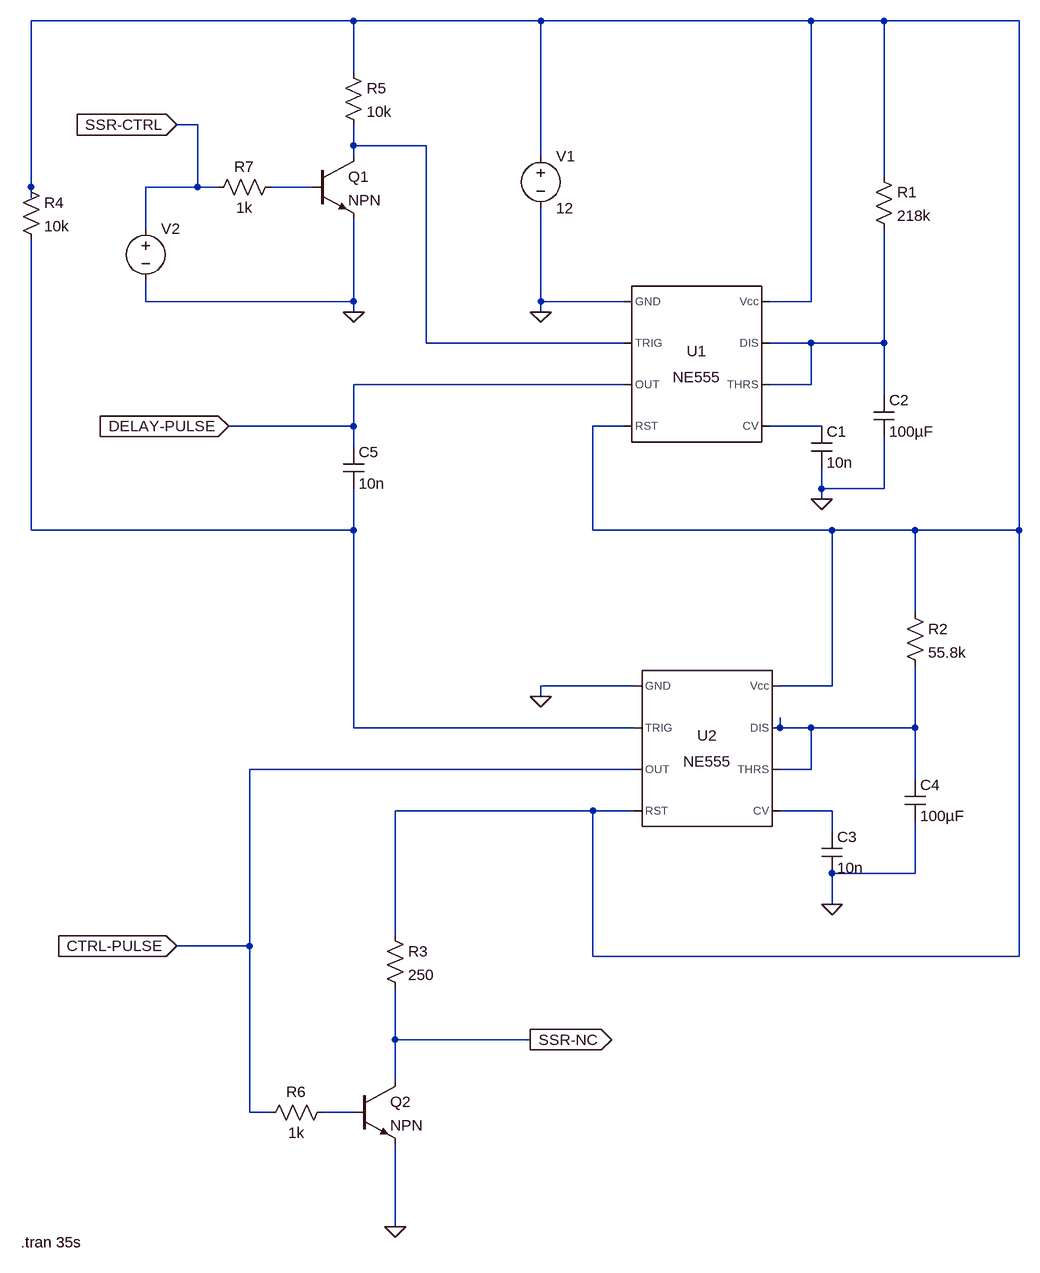
[diagram p0: schematic ssr_5v_pwr_ctrl.asc]
ssr_5v_pwr_ctrl.asc, the LTspice schematic file:
Version 4
SHEET 1 980 1544
WIRE -352 -352 -848 -352
WIRE -64 -352 -352 -352
WIRE 352 -352 -64 -352
WIRE 464 -352 352 -352
WIRE 672 -352 464 -352
WIRE -352 -272 -352 -352
WIRE -592 -192 -624 -192
WIRE -352 -160 -352 -192
WIRE -240 -160 -352 -160
WIRE -352 -144 -352 -160
WIRE -64 -144 -64 -352
WIRE 464 -112 464 -352
WIRE -848 -96 -848 -352
WIRE -592 -96 -592 -192
WIRE -592 -96 -672 -96
WIRE -560 -96 -592 -96
WIRE -416 -96 -480 -96
WIRE -848 -80 -848 -96
WIRE -672 -32 -672 -96
WIRE -672 80 -672 48
WIRE -352 80 -352 -48
WIRE -352 80 -672 80
WIRE -64 80 -64 -64
WIRE 64 80 -64 80
WIRE 352 80 352 -352
WIRE 352 80 288 80
WIRE -352 96 -352 80
WIRE -64 96 -64 80
WIRE -240 144 -240 -160
WIRE 64 144 -240 144
WIRE 352 144 288 144
WIRE 464 144 464 -32
WIRE 464 144 352 144
WIRE 64 208 -352 208
WIRE 352 208 352 144
WIRE 352 208 288 208
WIRE 464 224 464 144
WIRE -352 272 -352 208
WIRE -352 272 -544 272
WIRE 64 272 16 272
WIRE 368 272 288 272
WIRE -352 304 -352 272
WIRE 368 368 368 336
WIRE 464 368 464 288
WIRE 464 368 368 368
WIRE 368 384 368 368
WIRE -848 432 -848 -16
WIRE -352 432 -352 368
WIRE -352 432 -848 432
WIRE 16 432 16 272
WIRE 384 432 16 432
WIRE 512 432 384 432
WIRE 672 432 672 -352
WIRE 672 432 512 432
WIRE 512 560 512 432
WIRE 80 672 -64 672
WIRE 384 672 384 432
WIRE 384 672 304 672
WIRE -64 688 -64 672
WIRE -352 736 -352 432
WIRE 80 736 -352 736
WIRE 304 736 304 720
WIRE 352 736 304 736
WIRE 512 736 512 640
WIRE 512 736 352 736
WIRE 80 800 -512 800
WIRE 352 800 352 736
WIRE 352 800 304 800
WIRE 512 816 512 736
WIRE 16 864 -288 864
WIRE 80 864 16 864
WIRE 384 864 304 864
WIRE 384 896 384 864
WIRE 512 960 512 880
WIRE 512 960 384 960
WIRE 384 1008 384 960
WIRE -288 1056 -288 864
WIRE -512 1072 -512 800
WIRE -512 1072 -624 1072
WIRE 16 1088 16 864
WIRE 672 1088 672 432
WIRE 672 1088 16 1088
WIRE -288 1216 -288 1136
WIRE -80 1216 -288 1216
WIRE -288 1280 -288 1216
WIRE -512 1328 -512 1072
WIRE -480 1328 -512 1328
WIRE -352 1328 -400 1328
WIRE -288 1504 -288 1376
FLAG 368 384 0
FLAG -64 96 0
FLAG 384 1008 0
FLAG -64 688 0
FLAG -352 96 0
FLAG -288 1504 0
FLAG -80 1216 SSR-NC
IOPIN -80 1216 Out
FLAG -624 -192 SSR-CTRL
IOPIN -624 -192 In
FLAG -544 272 DELAY-PULSE
IOPIN -544 272 In
FLAG -624 1072 CTRL-PULSE
IOPIN -624 1072 In
SYMBOL Misc\\NE555 176 176 R0
SYMATTR InstName U1
SYMBOL cap 352 272 R0
SYMATTR InstName C1
SYMATTR Value 10n
SYMBOL res 448 -128 R0
SYMATTR InstName R1
SYMATTR Value 218k
SYMBOL cap 448 224 R0
SYMATTR InstName C2
SYMATTR Value 100µF
SYMBOL voltage -64 -160 R0
WINDOW 123 0 0 Left 2
WINDOW 39 0 0 Left 2
SYMATTR InstName V1
SYMATTR Value 12
SYMBOL voltage -672 -48 R0
WINDOW 3 24 96 Invisible 2
WINDOW 123 0 0 Left 2
WINDOW 39 0 0 Left 2
SYMATTR Value PULSE(0 3.3 1 0 0 0.1 1 1)
SYMATTR InstName V2
SYMBOL Misc\\NE555 192 768 R0
SYMATTR InstName U2
SYMBOL cap 368 896 R0
SYMATTR InstName C3
SYMATTR Value 10n
SYMBOL res 496 544 R0
SYMATTR InstName R2
SYMATTR Value 55.8k
SYMBOL cap 496 816 R0
SYMATTR InstName C4
SYMATTR Value 100µF
SYMBOL res -864 -112 R0
SYMATTR InstName R4
SYMATTR Value 10k
SYMBOL cap -368 304 R0
SYMATTR InstName C5
SYMATTR Value 10n
SYMBOL npn -416 -144 R0
SYMATTR InstName Q1
SYMBOL res -368 -288 R0
SYMATTR InstName R5
SYMATTR Value 10k
SYMBOL npn -352 1280 R0
SYMATTR InstName Q2
SYMBOL res -304 1040 R0
SYMATTR InstName R3
SYMATTR Value 250
SYMBOL res -384 1312 R90
WINDOW 0 0 56 VBottom 2
WINDOW 3 32 56 VTop 2
SYMATTR InstName R6
SYMATTR Value 1k
SYMBOL res -464 -112 R90
WINDOW 0 0 56 VBottom 2
WINDOW 3 32 56 VTop 2
SYMATTR InstName R7
SYMATTR Value 1k
TEXT -864 1528 Left 2 !.tran 35s

The netlist it stands for:
* ssr_5v_pwr_ctrl.asc
XU1 0 N002 DELAY-PULSE N001 N005 N004 N004 N001 NE555  ; pins GND TRIG OUT RST CV THRS DIS Vcc
C1 N005 0 10n
R1 N001 N004 218k
C2 N004 0 100µF
V1 N001 0 12
V2 SSR-CTRL 0 PULSE(0 3.3 1 0 0 0.1 1 1)
XU2 0 N006 CTRL-PULSE N001 N008 N007 N007 N001 NE555  ; pins GND TRIG OUT RST CV THRS DIS Vcc
C3 N008 0 10n
R2 N001 N007 55.8k
C4 N007 0 100µF
R4 N001 N006 10k
C5 DELAY-PULSE N006 10n
Q1 N002 N003 0 0 NPN
R5 N001 N002 10k
Q2 SSR-NC N009 0 0 NPN
R3 N001 SSR-NC 250
R6 N009 CTRL-PULSE 1k
R7 N003 SSR-CTRL 1k
.model NPN NPN
.model PNP PNP
.lib standard.bjt
.tran 35s
.lib NE555.sub
.backanno
.end